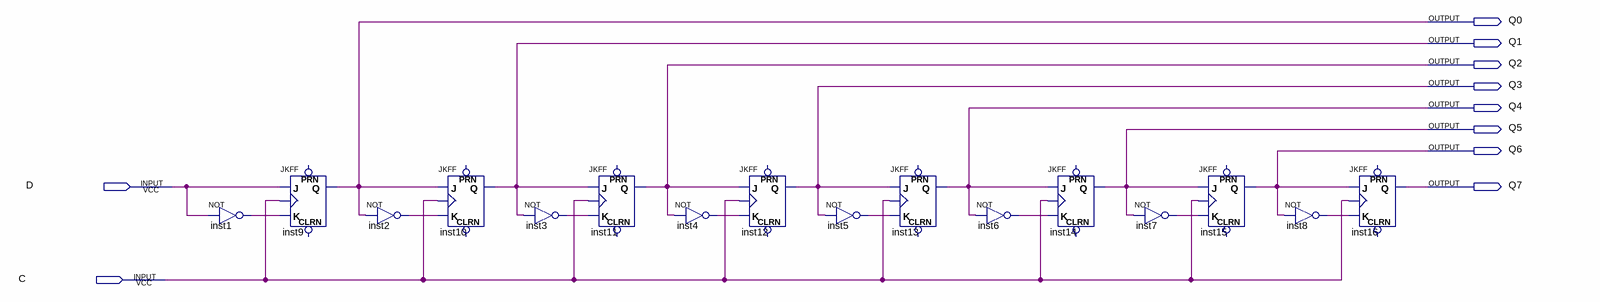
[diagram p0: schematic sheet]
// Quartus schematic laba1.bdf as structural Verilog: 16 symbols, 10 pins
module laba1 (
  input  D,
  input  C,
  output Q0,
  output Q1,
  output Q2,
  output Q3,
  output Q4,
  output Q5,
  output Q6,
  output Q7
);

  wire inst1_out, inst2_out, inst3_out, inst4_out, inst5_out, inst6_out, inst7_out, inst8_out;

  not inst1 (inst1_out, D);
  JKFF inst9 (.K(inst1_out), .J(D), .CLK(C), .Q(Q0));  // open: PRN, CLRN
  not inst2 (inst2_out, Q0);
  JKFF inst10 (.K(inst2_out), .J(Q0), .CLK(C), .Q(Q1));  // open: PRN, CLRN
  not inst3 (inst3_out, Q1);
  JKFF inst11 (.K(inst3_out), .J(Q1), .CLK(C), .Q(Q2));  // open: PRN, CLRN
  not inst4 (inst4_out, Q2);
  JKFF inst12 (.K(inst4_out), .J(Q2), .CLK(C), .Q(Q3));  // open: PRN, CLRN
  not inst5 (inst5_out, Q3);
  JKFF inst13 (.K(inst5_out), .J(Q3), .CLK(C), .Q(Q4));  // open: PRN, CLRN
  not inst6 (inst6_out, Q4);
  JKFF inst14 (.K(inst6_out), .J(Q4), .CLK(C), .Q(Q5));  // open: PRN, CLRN
  not inst7 (inst7_out, Q5);
  JKFF inst15 (.K(inst7_out), .J(Q5), .CLK(C), .Q(Q6));  // open: PRN, CLRN
  not inst8 (inst8_out, Q6);
  JKFF inst16 (.K(inst8_out), .J(Q6), .CLK(C), .Q(Q7));  // open: PRN, CLRN
endmodule
